# Altium schematic sheet MC50_BLE.SchDoc
size A3
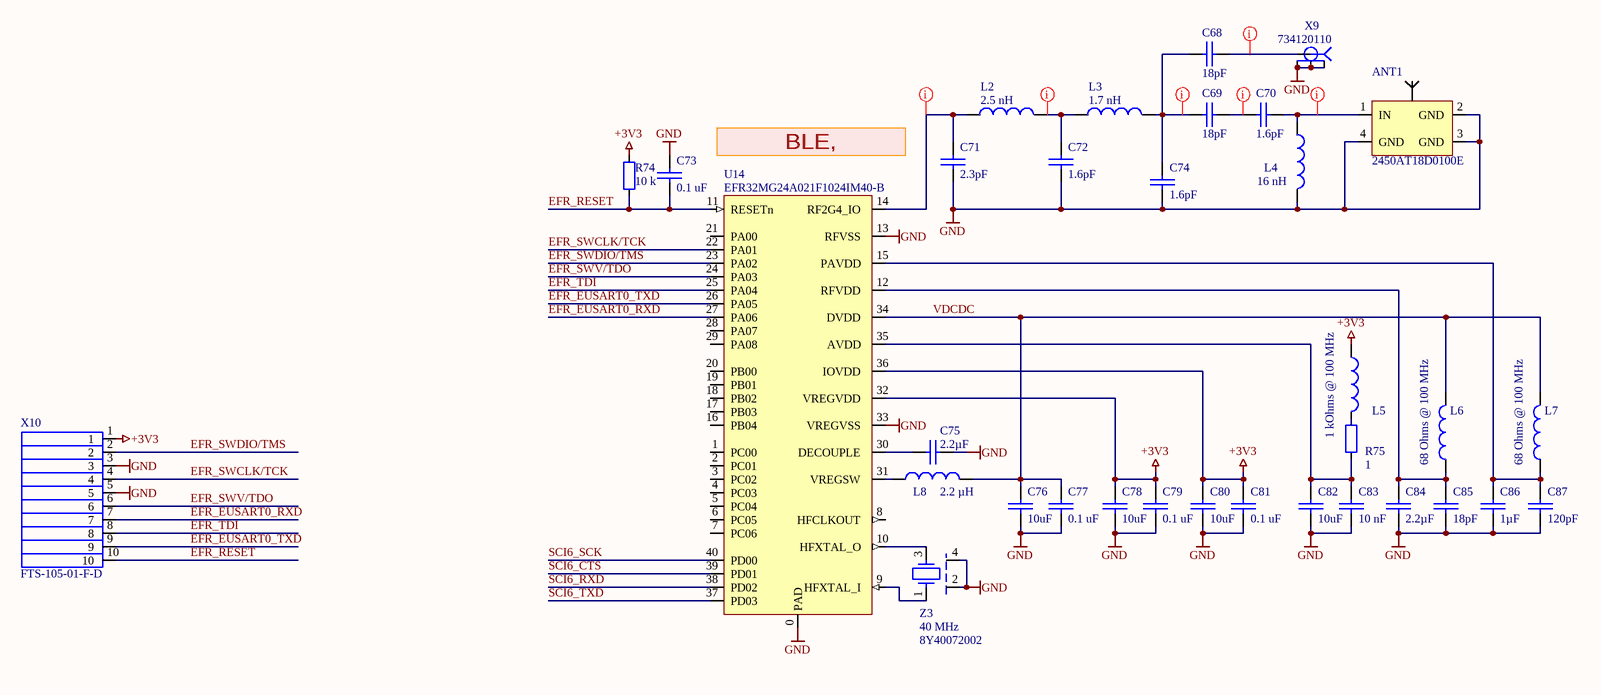
[diagram p0: MC50_BLE.SchDoc]

## Parts
ANT1  2450AT18D0100E  [2450AT18D0100E_JOT]
C68  value 18pF  [0402 CAP]  (hidden comment: Capacitor)
C69  value 18pF  [0402 CAP]  (hidden comment: Capacitor)
C70  value 1.6pF  [0402 CAP]  (hidden comment: Capacitor)
C71  value 2.3pF  [0402 CAP]  (hidden comment: Capacitor)
C72  value 1.6pF  [0402 CAP]  (hidden comment: Capacitor)
C73  value 0.1 uF  [1608[0603]]  (hidden comment: CL10B104KA8NNND)
C74  value 1.6pF  [0402 CAP]  (hidden comment: Capacitor)
C75  value 2.2µF  [0603 CAP]  (hidden comment: GRM188R71A225KE15D)
C76  value 10uF  [1608[0603]]  (hidden comment: GRM188R61E106KA73D)
C77  value 0.1 uF  [1608[0603]]  (hidden comment: CL10B104KA8NNND)
C78  value 10uF  [1608[0603]]  (hidden comment: GRM188R61E106KA73D)
C79  value 0.1 uF  [1608[0603]]  (hidden comment: CL10B104KA8NNND)
C80  value 10uF  [1608[0603]]  (hidden comment: GRM188R61E106KA73D)
C81  value 0.1 uF  [1608[0603]]  (hidden comment: CL10B104KA8NNND)
C82  value 10uF  [1608[0603]]  (hidden comment: GRM188R61E106KA73D)
C83  value 10 nF  [0603 CAP]  (hidden comment: Capacitor)
C84  value 2.2µF  [0603 CAP]  (hidden comment: GRM188R71A225KE15D)
C85  value 18pF  [0603 CAP]  (hidden comment: Capacitor)
C86  value 1µF  [0603 CAP]  (hidden comment: Capacitor)
C87  value 120pF  [0603 CAP]  (hidden comment: Capacitor)
L2  value 2.5 nH  [INDC1005-0402]  (hidden comment: ATFC-0402-2N5B-T)
L3  value 1.7 nH  [INDC1005-0402]  (hidden comment: ATFC-0402-1N7B-T)
L4  value 16 nH  [INDC1005-0402]  (hidden comment: 0402HP-160EJTS)
L5  value 1 kOhms @ 100 MHz  [0603]  (hidden comment: HZ0603B102R-10)
L6  value 68 Ohms @ 100 MHz  [0603]  (hidden comment: ILBB0603ER680V)
L7  value 68 Ohms @ 100 MHz  [0603]  (hidden comment: ILBB0603ER680V)
L8  value 2.2 µH  [0603]  (hidden comment: LQM18PZ2R2MFHD)
R74  value 10 k  [0603]  (hidden comment: Resistor)
R75  value 1  [0603]  (hidden comment: Resistor)
U14  EFR32MG24A021F1024IM40-B  [QFN40 Silabs]
X9  734120110  [0734120110]
X10  FTS-105-01-F-D  [FTS-105-01-F-D]
Z3  8Y40072002  value 40 MHz  [4-SMD 2.00mm x 1.60mm]

## Nets
+3V3: C78.1 C79.2 C80.1 C81.2 L5.1 R74.1 U14.32(VREGVDD) U14.36(IOVDD) X10.1
GND: ANT1.2(GND) ANT1.3(GND) ANT1.4(GND) C71.2 C72.2 C73.2 C74.2 C75.2 C76.2 C77.1 C78.2 C79.1 C80.2 C81.1 C82.2 C83.2 C84.1 C85.2 C86.2 C87.2 L4.2 U14.0(PAD) U14.13(RFVSS) U14.33(VREGVSS) X9.2 X9.3 X9.4 X10.3 X10.5 Z3.2 Z3.4
EFR_EUSART0_RXD: U14.27(PA06) X10.7
EFR_EUSART0_TXD: U14.26(PA05) X10.9
EFR_RESET: C73.1 R74.2 U14.11(RESETn) X10.10
EFR_SWCLK/TCK: U14.22(PA01) X10.4
EFR_SWDIO/TMS: U14.23(PA02) X10.2
EFR_SWV/TDO: U14.24(PA03) X10.6
EFR_TDI: U14.25(PA04) X10.8
SCI6_CTS: U14.39(PD01)
SCI6_RXD: U14.38(PD02)
SCI6_SCK: U14.40(PD00)
SCI6_TXD: U14.37(PD03)
VDCDC: C76.1 C77.2 L6.2 L7.2 L8.2 U14.34(DVDD)
NetANT1_1: ANT1.1(IN) C70.2 L4.1
NetC68_1: C68.1 C69.1 C74.1 L3.2
NetC68_2: C68.2 X9.1(Sig)
NetC69_2: C69.2 C70.1
NetC71_1: C71.1 L2.1 U14.14(RF2G4_IO)
NetC72_1: C72.1 L2.2 L3.1
NetC75_1: C75.1 U14.30(DECOUPLE)
NetC82_1: C82.1 C83.1 R75.1 U14.35(AVDD)
NetC84_2: C84.2 C85.1 L6.1 U14.12(RFVDD)
NetC86_1: C86.1 C87.1 L7.1 U14.15(PAVDD)
NetL5_2: L5.2 R75.2
NetL8_1: L8.1 U14.31(VREGSW)
NetU14_9: U14.9(HFXTAL_I) Z3.1
NetU14_10: U14.10(HFXTAL_O) Z3.3

Not connected (* = marked no-connect by the designer): U14 1(PC00_) 2(PC01_) 3(PC02_) 4(PC03_) 5(PC04_) 6(PC05_) 7(PC06_) 8(HFCLKOUT_) 16(PB04_) 17(PB03_) 18(PB02_) 19(PB01_) 20(PB00_) 21(PA00_) 28(PA07_) 29(PA08_)

## Layout directives
net class RF: NetANT1_1, NetC68_1, NetC68_2, NetC69_2, NetC71_1, NetC72_1

## Notes on the sheet
- BLE, IEE802.15.4

## Library data of the parts
ANT1 = 2450AT18D0100E: 2.4GHz Chip RF Antenna 2.4GHz ~ 2.5GHz 1.5dBi Solder Surface Mount; PartNum: 712-1573-1-ND; Manufacturer: Johanson Technology Inc.; PartName: 2450AT18D0100E; Distributor: Digi-Key
C68 C69 = CC0402JRNPO9BN180: 18pF, ±5%, 50V, C0G, NP0, 0402 (1005 Metric), -55°C ~ 125°C, -, General Purpose; Manufacturer: Yageo; PartNum: 311-1415-1-ND; Part Number: CC0402JRNPO9BN180; Distributor: Digi-Key; PartName: CC0402JRNPO9BN180; Price: 0.10000; Tolerance: ±5%; Voltage - Rated: 50V; Temperature Coefficient: C0G, NP0; Operating Temperature: -55°C ~ 125°C; Features: -; Package / Case: 0402 (1005 Metric)
C70 C72 C74 = CC0402BRNPO9BN1R6: 1.6pF, ±0.1pF, 50V, C0G, NP0, 0402 (1005 Metric), -55°C ~ 125°C, -, General Purpose; Manufacturer: Yageo; PartNum: 311-3702-1-ND; Part Number: CC0402BRNPO9BN1R6; Distributor: Digi-Key; PartName: CC0402BRNPO9BN1R6; Price: 0.10000; Tolerance: ±0.1pF; Voltage - Rated: 50V; Temperature Coefficient: C0G, NP0; Operating Temperature: -55°C ~ 125°C; Features: -; Package / Case: 0402 (1005 Metric)
C71 = 885392005009: 2.3pF, ±0.05pF, 50V, C0G, NP0, 0402 (1005 Metric), -55°C ~ 125°C, -, RF, Microwave, High Frequency; Manufacturer: Wurth Electronics Inc.; PartNum: 732-13234-1-ND; Part Number: 885392005009; Distributor: Digi-Key; PartName: 885392005009; Price: 0.15000; Tolerance: ±0.05pF; Voltage - Rated: 50V; Temperature Coefficient: C0G, NP0; Operating Temperature: -55°C ~ 125°C; Features: -; Package / Case: 0402 (1005 Metric)
C73 C77 C79 C81 = 0603B104K500CT: 0.1 µF ±10% 50V Ceramic Capacitor X7R 0603 (1608 Metric), / -55°C ~ 125°C; Manufacturer: Walsin Technology Corporation; PartNum: 1292-1643-1-ND; Tolerance: +-10%; Distributor: Digi-Key; PartName: 0603B104K500CT; Voltage: 50V; Price: 0.0062 Euro
C75 C84 = GRM188R71A225KE15D: 2.2µF, ±10%, 10V, X7R, 0603 (1608 Metric), -55°C ~ 125°C, -, General Purpose; Manufacturer: Murata Electronics North America; PartNum: 490-4520-1-ND; Part Number: GRM188R71A225KE15D; Distributor: Digi-Key; PartName: GRM188R71A225KE15D; Price: 0.18800; Tolerance: ±10%; Voltage - Rated: 10V; Temperature Coefficient: X7R; Operating Temperature: -55°C ~ 125°C; Features: -; Package / Case: 0603 (1608 Metric); Supplier 1: Farnell; Supplier Part Number 1: 2666507
C76 C78 C80 C82 = GRM188R61E106KA73D: 10 µF ±10% 25V Ceramic Capacitor X5R 0603 (1608 Metric), -55°C ~ 85°C; Manufacturer: Murata Electronics; PartNum: 490-18214-1-ND; Tolerance: ±10%; Price: 0.41$; Distributor: Digi-Key; Voltage: 25V; PartName: GRM188R61E106KA73D
C83 = C1608C0G1H103J080AA: 10000pF, ±5%, 50V, C0G, NP0, 0603 (1608 Metric), -55°C ~ 125°C, Low ESL, General Purpose; Manufacturer: TDK Corporation; PartNum: 445-7404-1-ND; Part Number: C1608C0G1H103J080AA; Distributor: Digi-Key; PartName: C1608C0G1H103J080AA; Price: 0.15090; Tolerance: ±5%; Voltage - Rated: 50V; Temperature Coefficient: C0G, NP0; Operating Temperature: -55°C ~ 125°C; Features: Low ESL; Package / Case: 0603 (1608 Metric)
C85 = C0603C180K5GACTU: 18pF, ±10%, 50V, C0G, NP0, 0603 (1608 Metric), -55°C ~ 125°C, Low ESL, General Purpose; Manufacturer: KEMET; PartNum: 399-7866-1-ND; Part Number: C0603C180K5GACTU; Distributor: Digi-Key; PartName: C0603C180K5GACTU; Price: 0.03170; Tolerance: ±10%; Voltage - Rated: 50V; Temperature Coefficient: C0G, NP0; Operating Temperature: -55°C ~ 125°C; Features: Low ESL; Package / Case: 0603 (1608 Metric)
C86 = CL10A105KB8NNNC: 1µF, ±10%, 50V, X5R, 0603 (1608 Metric), -55°C ~ 85°C, -, General Purpose; Manufacturer: Samsung Electro-Mechanics; PartNum: 1276-1860-1-ND; Part Number: CL10A105KB8NNNC; Distributor: Digi-Key; PartName: CL10A105KB8NNNC; Price: 0.05980; Tolerance: ±10%; Voltage - Rated: 50V; Temperature Coefficient: X5R; Operating Temperature: -55°C ~ 85°C; Features: -; Package / Case: 0603 (1608 Metric)
C87 = CL10C121JB8NCNC: 120pF, ±5%, 50V, C0G, NP0, 0603 (1608 Metric), -55°C ~ 125°C, -, General Purpose; Manufacturer: Samsung Electro-Mechanics; PartNum: 1276-2180-1-ND; Part Number: CL10C121JB8NCNC; Distributor: Digi-Key; PartName: CL10C121JB8NCNC; Price: 0.01740; Tolerance: ±5%; Voltage - Rated: 50V; Temperature Coefficient: C0G, NP0; Operating Temperature: -55°C ~ 125°C; Features: -; Package / Case: 0603 (1608 Metric)
L2 = ATFC-0402-2N5B-T: 2.5 nH Unshielded Thin Film Inductor 440 mA 350mOhm Max 0402 (1005 Metric); Manufacturer: Abracon LLC; PartNum: 535-10366-1-ND; Tolerance: ±0.1nH; Distributor: Digi-Key; PartName: ATFC-0402-2N5B-T
L3 = ATFC-0402-1N7B-T: 1.7 nH Unshielded Thin Film Inductor 560 mA 250mOhm Max 0402 (1005 Metric); Manufacturer: Abracon LLC; PartNum: 535-10358-1-ND; Tolerance: ±0.1nH; Distributor: Digi-Key; PartName: ATFC-0402-1N7B-T
L4 = 0402HP-160EJTS: 16 nH Unshielded Drum Core, Wirewound Inductor 850 mA 130mOhm 0402 (1005 Metric); Manufacturer: Delta Electronics/Components; PartNum: 2035-1532-1-ND; Tolerance: 5%; Distributor: Digi-Key; PartName: 0402HP-160EJTS
L5 = HZ0603B102R-10: 1 kOhms @ 100 MHz 1 Power, Signal Line Ferrite Bead 0603 (1608 Metric) 200mA 600mOhm; Manufacturer: Laird-Signal Integrity Products; PartNum: 240-2378-1-ND; Distributor: Digi-Key; Price: 0.06$; PartName: HZ0603B102R-10
L6 L7 = ILBB0603ER680V: 68 Ohms @ 100 MHz 1 Ferrite Bead 0603 (1608 Metric) 200mA 100mOhm, -55°C ~ 125°C; Manufacturer: Murata Manufacturing; PartNum: 541-2605-1-ND; Distributor: Digi-Key; Price: 0.11; PartName: ILBB0603ER680V
L8 = LQM18PZ2R2MFHD: 2.2 µH Shielded Multilayer Inductor 700 mA 470mOhm Max 0603 (1608 Metric); Manufacturer: Murata Electronics; PartNum: 490-15982-1-ND; Tolerance: ±20%; Distributor: Digi-Key; Price: 0.2; PartName: LQM18PZ2R2MFHD
R74 = CR0603-FX-1002GLF: 10 kOhms, ±1%, 0.1W, 1/10W, Thick Film, ±100ppm/°C, 0603 (1608 Metric), -55°C ~ 155°C, Moisture Resistant; Manufacturer: Bourns Inc.; PartNum: CR0603-FX-1002GLFCT-ND; Voltage: 75V; Distributor: Digi-Key; Price: 0.00860; Tolerance: ±1%; PartName: CR0603-FX-1002GLF; Part Number: CR0603-FX-1002GLF; Temperature Coefficient: ±100ppm/°C; Operating Temperature: -55°C ~ 155°C; Power (Watts): 0.1W, 1/10W; Features: Moisture Resistant; Package / Case: 0603 (1608 Metric)
R75 = RCG06031R00FKEA: 1 Ohms, ±1%, 0.1W, 1/10W, Thick Film, ±100ppm/°C, 0603 (1608 Metric), -55°C ~ 155°C, -; Manufacturer: Vishay Dale; PartNum: 541-1776-1-ND; Voltage: 75V; Distributor: Digi-Key; Price: 0.04050; Tolerance: ±1%; PartName: RCG06031R00FKEA; Part Number: RCG06031R00FKEA; Temperature Coefficient: ±100ppm/°C; Operating Temperature: -55°C ~ 155°C; Power (Watts): 0.1W, 1/10W; Features: -; Package / Case: 0603 (1608 Metric)
U14 = EFR32MG24A021F1024IM40-B: IC RF TxRx + MCU Bluetooth Bluetooth v5.3 2.4GHz,  1024KB FLASH, 128KB RAM, 40-VFQFN Exposed Pad, -40°C ~ 125°C (TA); Manufacturer: Silicon Labs; PartNum: 336-EFR32MG24A021F1024IM40-B-ND; Distributor: Digi-Key; PartName: EFR32MG24A021F1024IM40-B; Price: 6$
X9 = 0734120110: U.FL (UMCC) Connector Receptacle, Male Pin 50 Ohm Surface Mount Solder; Manufacturer: Molex; PartNum: WM5587TR-ND; Distributor: Digi-Key; PartName: 0734120110
X10 = FTS-105-01-F-D: Board-To-Board Connector, Vertical, FTS Series, Through Hole, Header, 10, 1.27 mm; Manufacturer: SAMTEC; PartNum: 1928242; Distributor: Farnell; PartName: FTS-105-01-F-D
Z3 = 8Y40072002: 40 MHz Crystal 8pF 80 Ohms 4-SMD, No Lead, -20°C ~ 70°C; Manufacturer: TXC CORPORATION; PartNum: 887-8Y40072002CT-ND; Distributor: Digi-Key; PartName: 8Y40072002